# Altium project ControlBoard.PrjPcb (part 8 of 8)

## Sheet Voltages.SchDoc: Title
size A4; SchTemplateVer: V2.0; Author: Adam Mizerkiewicz; CompanyName: Adam Mizerkiewicz; DrawnBy: Adam Mizerkiewicz; Engineer: Adam Mizerkiewicz; Organization: Adam Mizerkiewicz; Address1: Sarnia 2/19; Address2: 61-058 Poznań; Revision: 0.0
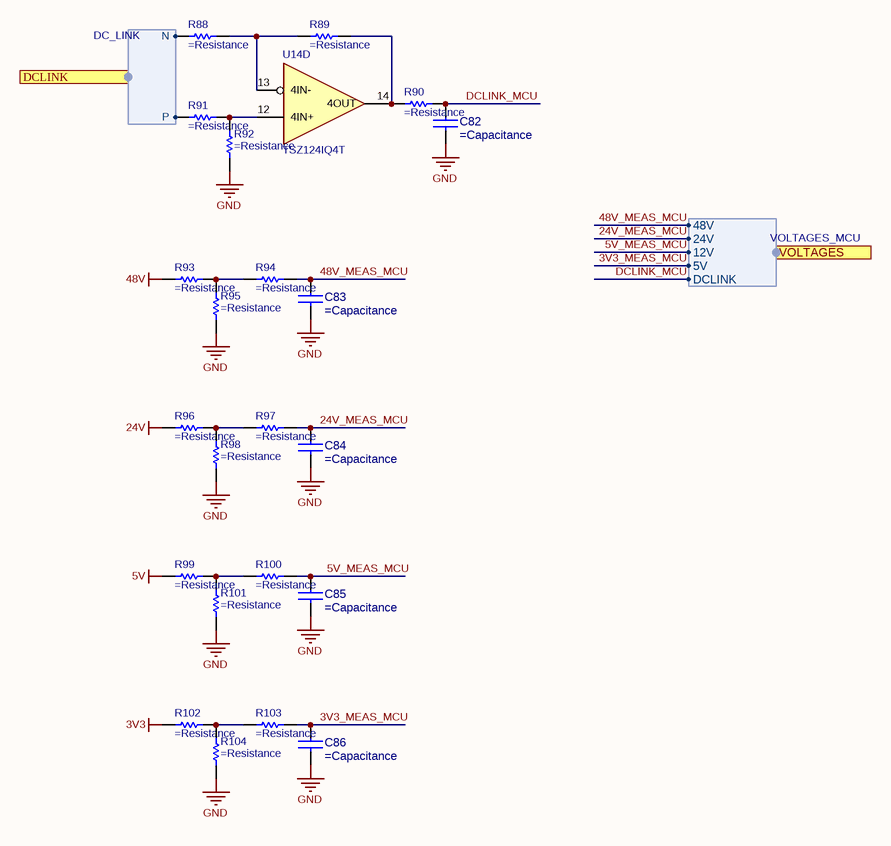
[diagram p15: Voltages.SchDoc]

### Parts
C82  (no value)  [C0402]
C83  (no value)  [C0402]
C84  (no value)  [C0402]
C85  (no value)  [C0402]
C86  (no value)  [C0402]
R88  (no value)  [R0402]
R89  (no value)  [R0402]
R90  (no value)  [R0402]
R91  (no value)  [R0402]
R92  (no value)  [R0402]
R93  (no value)  [R0402]
R94  (no value)  [R0402]
R95  (no value)  [R0402]
R96  (no value)  [R0402]
R97  (no value)  [R0402]
R98  (no value)  [R0402]
R99  (no value)  [R0402]
R100  (no value)  [R0402]
R101  (no value)  [R0402]
R102  (no value)  [R0402]
R103  (no value)  [R0402]
R104  (no value)  [R0402]
U14  TSZ124IQ4T  [VQFN16]  (part D of 5)

### Ports
DCLINK (harness DC_LINK), VOLTAGES (harness VOLTAGES_MCU)

### Harnesses
VOLTAGES_MCU: 24V, 12V, 5V, DCLINK, 48V
DC_LINK: N, P

### Nets
3V3: R102.1
5V: R99.1
24V: R96.1
48V: R93.1
GND: C82.2 C83.2 C84.2 C85.2 C86.2 R92.1 R95.1 R98.1 R101.1 R104.1
3V3_MEAS_MCU: C86.1 R103.2 ; port VOLTAGES.5V
5V_MEAS_MCU: C85.1 R100.2 ; port VOLTAGES.12V
24V_MEAS_MCU: C84.1 R97.2 ; port VOLTAGES.24V
48V_MEAS_MCU: C83.1 R94.2 ; port VOLTAGES.48V
DCLINK_MCU: C82.1 R90.2 ; port VOLTAGES.DCLINK
DCLINK_N: R88.1 ; port DCLINK.N
DCLINK_P: R91.1 ; port DCLINK.P
NetR88_2: R88.2 R89.1 U14.13(4IN-)
NetR89_2: R89.2 R90.1 U14.14(4OUT)
NetR91_2: R91.2 R92.2 U14.12(4IN+)
NetR93_2: R93.2 R94.1 R95.2
NetR96_2: R96.2 R97.1 R98.2
NetR99_2: R99.2 R100.1 R101.2
NetR102_2: R102.2 R103.1 R104.2

### Notes on the sheet
- Revision
  =Revision
- Sheet
  =SheetNumber / =SheetTotal

### Library data of the parts
C82-C86 = CAP0402-6.8nF-25V: Multilayer Ceramic Capacitors MLCC - SMD/SMT 25V 6800pF X7R 0402 10% AEC-Q200; Manufacturer: KEMET; Manufacturer Part Number: C0402C682K3RACAUTO; Capacitance: 6.8nF; Value: 6.8nF; Supplier 1: DigiKey; Supplier Part Number 1: 399-C0402C682K3RACAUTOCT-ND; Supplier: DigiKey; Supplier Part Number: 399-C0402C682K3RACAUTOCT-ND; RoHS: Compliant; Category: Ceramic Capacitors; Stock: 9600; Pricing: 1=0,26, 10=0,122, 50=0,075, 100=0,0595, 500=0,0515 (USD); Case/Package: 0402; China RoHS: Compliant; Dielectric: X7R; Dielectric Material: Ceramic; Height: 500µm; Length: 1mm; Lifecycle Status: Production; Material: Ceramic; Max Operating Temperature: 125°C; Min Operating Temperature: -55°C; Mounting Technology: Surface Mount; Pins: 2; Number of Terminals: 2; REACH SVHC: Yes; Voltage Rating: 25V; Voltage Rating (DC): 25V; Width: 500µm; ComponentLink1URL: https://datasheet.octopart.com:443/C0402C682K3RACAUTO-KEMET-datasheet-178087915.pdf?src-supplier=IHS; ComponentLink1Description: https://datasheet.octopart.com:443/C0402C682K3RACAUTO-KEMET-datasheet-178087915.pdf?src-supplier=IHS; ComponentLink2URL: https://datasheet.octopart.com:443/C0402C682K3RACAUTO-KEMET-datasheet-137357759.pdf?src-supplier=Upverter; ComponentLink2Description: https://datasheet.octopart.com:443/C0402C682K3RACAUTO-KEMET-datasheet-137357759.pdf?src-supplier=Upverter; ComponentLink3URL: https://datasheet.octopart.com:443/C0402C682K3RACAUTO-KEMET-datasheet-153706760.pdf?src-supplier=Electro+Sonic; ComponentLink3Description: https://datasheet.octopart.com:443/C0402C682K3RACAUTO-KEMET-datasheet-153706760.pdf?src-supplier=Electro+Sonic; ComponentLink4URL: https://datasheet.octopart.com:443/C0402C682K3RACAUTO-KEMET-datasheet-138896278.pdf?src-supplier=Farnell; ComponentLink4Description: https://datasheet.octopart.com:443/C0402C682K3RACAUTO-KEMET-datasheet-138896278.pdf?src-supplier=Farnell; ComponentLink5URL: https://datasheet.octopart.com/C0402C682K3RACAUTO-KEMET-datasheet-84169754.pdf; ComponentLink5Description: https://datasheet.octopart.com/C0402C682K3RACAUTO-KEMET-datasheet-84169754.pdf
R88 R90 R91 = RES0402-1k-1%: Res Thick Film 0402 1K Ohm 1% 0.063W(1/16W) ±50ppm/C Pad SMD Automotive T/R; Manufacturer: Vishay; Manufacturer Part Number: CRCW04021K00FHEDP; Resistance: 1kΩ; Max Power Dissipation: 63mW; Value: 1kΩ; Temperature Coefficient: 50ppm/°C; Voltage Rating: 50V; Supplier 1: DigiKey; Supplier Part Number 1: CRCW04021K00FHEDP-ND; Supplier: DigiKey; Supplier Part Number: CRCW04021K00FHEDP-ND; RoHS: Compliant; Category: Chip SMD Resistors; Pricing: 10000=0,03252 (USD); Case/Package: 0402; China RoHS: Non-Compliant; Composition: Thick Film; Contact Plating: Tin; Depth: 500µm; Features: Automotive AEC-Q200; Height: 350µm; Length: 990.6µm; Lifecycle Status: Production; Max Operating Temperature: 155°C; Military Standard: Not; Min Operating Temperature: -55°C; Mounting Technology: Surface Mount; Number of Terminals: 2; Number of Terminations: 2; Packaging: Tape & Reel; Power Dissipation: 63mW; Power Rating: 63mW; Radiation Hardening: No; REACH SVHC: Yes; Tolerance: 1%; Width: 500µm; Working Voltage: 50V; ComponentLink1URL: https://datasheet.octopart.com:443/CRCW04021K00FHEDP-Vishay-datasheet-182027415.pdf?src-supplier=IHS; ComponentLink1Description: https://datasheet.octopart.com:443/CRCW04021K00FHEDP-Vishay-datasheet-182027415.pdf?src-supplier=IHS; ComponentLink2URL: https://datasheet.octopart.com:443/CRCW04021K00FHEDP-Vishay-Dale-datasheet-141207190.pdf?src-supplier=Upverter; ComponentLink2Description: https://datasheet.octopart.com:443/CRCW04021K00FHEDP-Vishay-Dale-datasheet-141207190.pdf?src-supplier=Upverter; ComponentLink3URL: http://sigma.octopart.com:80/rohs_statement/Vishay-company-15.pdf?src-supplier=Compliance+Statements; ComponentLink3Description: http://sigma.octopart.com:80/rohs_statement/Vishay-company-15.pdf?src-supplier=Compliance+Statements
R89 R92 R95 R98 = RES0402-2k-1%: Res Thick Film 0402 2K Ohm 1% 1/16W 100ppm/C Molded SMD SMD Paper T/R; Manufacturer: Vishay; Manufacturer Part Number: CRCW04022K00FKEE; Resistance: 2kΩ; Max Power Dissipation: 63mW; Value: 2kΩ; Temperature Coefficient: 100ppm/°C; Voltage Rating: 50V; Supplier 1: DigiKey; Supplier Part Number 1: 541-CRCW04022K00FKEECT-ND; Supplier: DigiKey; Supplier Part Number: 541-CRCW04022K00FKEECT-ND; RoHS: Compliant; Category: Chip SMD Resistors; Stock: 10445; Pricing: 1=0,1, 10=0,03, 25=0,0224, 50=0,018, 100=0,0148, 250=0,01156, 500=0,01056, 1000=0,0084, 5000=0,00637 (USD); Case/Package: 0402; China RoHS: Non-Compliant; Composition: Thick Film; Contact Plating: Tin; Features: Automotive AEC-Q200; Height: 350µm; Lead Free: Lead Free; Length: 990.6µm; Lifecycle Status: Production; Max Operating Temperature: 155°C; Min Operating Temperature: -55°C; Mounting Technology: Surface Mount; Number of Terminals: 2; Number of Terminations: 2; Packaging: Tape & Reel; Power Dissipation: 63mW; Power Rating: 63mW; Radiation Hardening: No; REACH SVHC: Yes; Tolerance: 1%; Width: 500µm; Working Voltage: 50V; ComponentLink1URL: https://datasheet.octopart.com:443/CRCW04022K00FKEE-Vishay-datasheet-175423584.pdf?src-supplier=IHS; ComponentLink1Description: https://datasheet.octopart.com:443/CRCW04022K00FKEE-Vishay-datasheet-175423584.pdf?src-supplier=IHS; ComponentLink2URL: https://datasheet.octopart.com/D-CRCW-e3-Standard-Thick-Film-Chip-Resistors-Vishay-datasheet-family-64.pdf; ComponentLink2Description: https://datasheet.octopart.com/D-CRCW-e3-Standard-Thick-Film-Chip-Resistors-Vishay-datasheet-family-64.pdf; ComponentLink3URL: http://sigma.octopart.com:80/rohs_certificate/D-CRCW-e3-Standard-Thick-Film-Chip-Resistors-Vishay-family-102.pdf?src-supplier=Compliance+Statements; ComponentLink3Description: http://sigma.octopart.com:80/rohs_certificate/D-CRCW-e3-Standard-Thick-Film-Chip-Resistors-Vishay-family-102.pdf?src-supplier=Compliance+Statements
R93 = RES0402-47k-1%: Res Thick Film 0402 47K Ohm 1% 0.063W(1/16W) ±100ppm/C Pad SMD T/R; Manufacturer: Vishay; Manufacturer Part Number: CRCW040247K0FKEDC; Resistance: 47kΩ; Power Dissipation: 63mW; Value: 47kΩ; Temperature Coefficient: 100ppm/°C; Voltage Rating: 50V; Supplier 1: DigiKey; Supplier Part Number 1: 541-3966-1-ND; Supplier: DigiKey; Supplier Part Number: 541-3966-1-ND; RoHS: Compliant; Category: Chip SMD Resistors; Stock: 190917; Pricing: 1=0,1, 10=0,028, 25=0,0208, 50=0,0168, 100=0,0138, 250=0,01072, 500=0,009, 1000=0,00766, 5000=0,00554 (USD); Case/Package: 0402; China RoHS: Non-Compliant; Composition: Thick Film; Contact Plating: Tin; Height: 300µm; Lead Free: Lead Free; Length: 1mm; Lifecycle Status: Production; Max Operating Temperature: 155°C; Min Operating Temperature: -55°C; Mounting Technology: Surface Mount; Number of Terminals: 2; Power Rating: 63mW; REACH SVHC: Yes; Schedule B: 8533210045, 8533210045|8533210045|8533210045|8533210045|8533210045|8533210045|8533210045|8533210045|8533210045|8533210045|8533210045|8533210045|8533210045|8533210045|8533210045|8533210045|8533210045|8533210045|8533210045|8533210045|8533210045|8533210045|8533210045|85; Termination: Wraparound; Tolerance: 1%; Width: 500µm; Working Voltage: 50V; ComponentLink1URL: https://datasheet.octopart.com:443/CRCW040247K0FKEDC-Vishay-datasheet-102570912.pdf?src-supplier=Future+Electronics; ComponentLink1Description: https://datasheet.octopart.com:443/CRCW040247K0FKEDC-Vishay-datasheet-102570912.pdf?src-supplier=Future+Electronics; ComponentLink2URL: https://datasheet.octopart.com:443/CRCW040247K0FKEDC-Vishay-datasheet-62316122.pdf?src-supplier=Future+Electronics; ComponentLink2Description: https://datasheet.octopart.com:443/CRCW040247K0FKEDC-Vishay-datasheet-62316122.pdf?src-supplier=Future+Electronics; ComponentLink3URL: https://datasheet.octopart.com:443/CRCW040247K0FKEDC-Vishay-datasheet-175423585.pdf?src-supplier=IHS; ComponentLink3Description: https://datasheet.octopart.com:443/CRCW040247K0FKEDC-Vishay-datasheet-175423585.pdf?src-supplier=IHS; ComponentLink4URL: http://sigma.octopart.com:80/rohs_statement/Vishay-company-15.pdf?src-supplier=Compliance+Statements; ComponentLink4Description: http://sigma.octopart.com:80/rohs_statement/Vishay-company-15.pdf?src-supplier=Compliance+Statements
R94 R97 R100 R102-R104 = RES0402-10k-1%: Res Thick Film 0402 10K Ohm 1% 0.063W(1/16W) ±100ppm/C Pad SMD T/R Automotive AEC-Q200; Manufacturer: Vishay; Manufacturer Part Number: CRCW040210K0FKEE; Resistance: 10kΩ; Max Power Dissipation: 63mW; Value: 10kΩ; Temperature Coefficient: 100ppm/°C; Voltage Rating: 50V; Supplier 1: DigiKey; Supplier Part Number 1: 541-2954-1-ND; Supplier: DigiKey; Supplier Part Number: 541-2954-1-ND; RoHS: Compliant; Category: Chip SMD Resistors; Pricing: 1=0,1, 10=0,03, 25=0,0224, 50=0,018, 100=0,0148, 250=0,01156, 500=0,00974, 1000=0,00832, 5000=0,00637 (USD); Case/Package: 0402; Case Code (Imperial): 0402; Case Code (Metric): 1005; China RoHS: Non-Compliant; Composition: Thick Film; Contact Plating: Tin; Depth: 500µm; Features: Automotive AEC-Q200; Height: 350µm; Lead Free: Lead Free; Length: 990.6µm; Lifecycle Status: Production; Max Operating Temperature: 155°C; Military Standard: Not; Min Operating Temperature: -55°C; Mounting Technology: Surface Mount; Number of Terminals: 2; Number of Terminations: 2; Packaging: Tape & Reel; Power Dissipation: 63mW; Power Rating: 63mW; Radiation Hardening: No; REACH SVHC: Yes; Schedule B: 8533210045, 8533210045|8533210045|8533210045|8533210045|8533210045|8533210045|8533210045|8533210045|8533210045|8533210045|8533210045|8533210045|8533210045|8533210045|8533210045|8533210045|8533210045|8533210045|8533210045|8533210045|8533210045|8533210045|8533210045|85; Tolerance: 1%; Voltage Rating (DC): 50V; Width: 500µm; Working Voltage: 50V; ComponentLink1URL: https://datasheet.octopart.com:443/CRCW040210K0FKEE-Vishay-datasheet-175423584.pdf?src-supplier=IHS; ComponentLink1Description: https://datasheet.octopart.com:443/CRCW040210K0FKEE-Vishay-datasheet-175423584.pdf?src-supplier=IHS; ComponentLink2URL: https://datasheet.octopart.com:443/CRCW040210K0FKEE-Vishay-datasheet-62316122.pdf?src-supplier=Future+Electronics; ComponentLink2Description: https://datasheet.octopart.com:443/CRCW040210K0FKEE-Vishay-datasheet-62316122.pdf?src-supplier=Future+Electronics; ComponentLink3URL: http://sigma.octopart.com:80/rohs_statement/Vishay-company-15.pdf?src-supplier=Compliance+Statements; ComponentLink3Description: http://sigma.octopart.com:80/rohs_statement/Vishay-company-15.pdf?src-supplier=Compliance+Statements
R96 R99 = RES0402-20k-1%: Res Thick Film 0402 20K Ohm 1% 0.063W(1/16W) ±100ppm/C Pad SMD T/R; Manufacturer: Vishay; Manufacturer Part Number: CRCW040220K0FKEDC; Resistance: 20kΩ; Power Dissipation: 63mW; Value: 20kΩ; Temperature Coefficient: 100ppm/°C; Voltage Rating: 50V; Supplier 1: DigiKey; Supplier Part Number 1: 541-3969-1-ND; Supplier: DigiKey; Supplier Part Number: 541-3969-1-ND; RoHS: Compliant; Category: Chip SMD Resistors; Stock: 7862; Pricing: 1=0,1, 10=0,028, 25=0,0208, 50=0,0168, 100=0,0138, 250=0,01072, 500=0,009, 1000=0,00766, 5000=0,00554 (USD); Case/Package: 0402; China RoHS: Non-Compliant; Composition: Thick Film; Contact Plating: Tin; Height: 300µm; Lead Free: Lead Free; Length: 1mm; Lifecycle Status: Production; Max Operating Temperature: 155°C; Min Operating Temperature: -55°C; Mounting Technology: Surface Mount; Number of Terminals: 2; Power Rating: 63mW; REACH SVHC: Yes; Schedule B: 8533210045, 8533210045|8533210045|8533210045|8533210045|8533210045; Termination: Wraparound; Tolerance: 1%; Width: 500µm; Working Voltage: 50V; ComponentLink1URL: https://datasheet.octopart.com:443/CRCW040220K0FKEDC-Vishay-datasheet-102570912.pdf?src-supplier=Upverter; ComponentLink1Description: https://datasheet.octopart.com:443/CRCW040220K0FKEDC-Vishay-datasheet-102570912.pdf?src-supplier=Upverter; ComponentLink2URL: https://datasheet.octopart.com:443/CRCW040220K0FKEDC-Vishay-datasheet-175423585.pdf?src-supplier=IHS; ComponentLink2Description: https://datasheet.octopart.com:443/CRCW040220K0FKEDC-Vishay-datasheet-175423585.pdf?src-supplier=IHS; ComponentLink3URL: https://datasheet.octopart.com:443/CRCW040220K0FKEDC-Vishay-datasheet-100063072.pdf?src-supplier=Future+Electronics; ComponentLink3Description: https://datasheet.octopart.com:443/CRCW040220K0FKEDC-Vishay-datasheet-100063072.pdf?src-supplier=Future+Electronics; ComponentLink4URL: https://datasheet.octopart.com:443/CRCW040220K0FKEDC-Vishay-datasheet-62316122.pdf?src-supplier=Future+Electronics; ComponentLink4Description: https://datasheet.octopart.com:443/CRCW040220K0FKEDC-Vishay-datasheet-62316122.pdf?src-supplier=Future+Electronics; ComponentLink5URL: http://sigma.octopart.com:80/rohs_statement/Vishay-company-15.pdf?src-supplier=Compliance+Statements; ComponentLink5Description: http://sigma.octopart.com:80/rohs_statement/Vishay-company-15.pdf?src-supplier=Compliance+Statements
R101 = RES0402-30k-1%: 0402 30K Ohms 1% High Power Thick Film Surface Mount Chip Resistor; Manufacturer: Vishay; Manufacturer Part Number: CRCW040230K0FKEDHP; Manufacturer Package Identifier: CRCW0402-HPe3; Resistance: 30kΩ; Max Power Dissipation: 125mW; Power Dissipation: 200mW; Value: 30kΩ; Temperature Coefficient: 100ppm/°C; Voltage Rating: 50V; Supplier 1: DigiKey; Supplier Part Number 1: CRCW040230K0FKEDHPCT-ND; Supplier: DigiKey; Supplier Part Number: CRCW040230K0FKEDHPCT-ND; RoHS: Compliant; Category: Chip SMD Resistors; Stock: 9449; Pricing: 1=0,13, 10=0,061, 25=0,0472, 50=0,0392, 100=0,0331, 250=0,027, 500=0,0235, 1000=0,02072, 5000=0,01631 (USD); Case/Package: 0402; Case Code (Imperial): 0402; Case Code (Metric): 1005; China RoHS: Non-Compliant; Composition: Thick Film; Contact Plating: Tin; Features: Automotive AEC-Q200; Height: 300µm; Lead Free: Lead Free; Length: 990.6µm; Lifecycle Status: Production; Max Operating Temperature: 155°C; Min Operating Temperature: -55°C; Mounting Technology: Surface Mount; Number of Terminals: 2; Number of Terminations: 2; Packaging: Digi-Reel®; Power Rating: 200mW; Radiation Hardening: No; REACH SVHC: Yes; Tolerance: 1%; Width: 500µm; Working Voltage: 50V; ComponentLink1URL: https://datasheet.octopart.com/CRCW040230K0FKEDHP-Vishay-datasheet-83567917.pdf; ComponentLink1Description: https://datasheet.octopart.com/CRCW040230K0FKEDHP-Vishay-datasheet-83567917.pdf; ComponentLink2URL: https://datasheet.octopart.com/D-CRCW-e3-Standard-Thick-Film-Chip-Resistors-Vishay-datasheet-family-64.pdf; ComponentLink2Description: https://datasheet.octopart.com/D-CRCW-e3-Standard-Thick-Film-Chip-Resistors-Vishay-datasheet-family-64.pdf; ComponentLink3URL: https://datasheet.octopart.com:443/CRCW040230K0FKEDHP-Vishay-datasheet-137113427.pdf?src-supplier=X-ON; ComponentLink3Description: https://datasheet.octopart.com:443/CRCW040230K0FKEDHP-Vishay-datasheet-137113427.pdf?src-supplier=X-ON; ComponentLink4URL: https://datasheet.octopart.com:443/CRCW040230K0FKEDHP-Vishay-datasheet-62316122.pdf?src-supplier=Future+Electronics; ComponentLink4Description: https://datasheet.octopart.com:443/CRCW040230K0FKEDHP-Vishay-datasheet-62316122.pdf?src-supplier=Future+Electronics; ComponentLink5URL: http://sigma.octopart.com:80/rohs_certificate/D-CRCW-e3-Standard-Thick-Film-Chip-Resistors-Vishay-family-102.pdf?src-supplier=Compliance+Statements; ComponentLink5Description: http://sigma.octopart.com:80/rohs_certificate/D-CRCW-e3-Standard-Thick-Film-Chip-Resistors-Vishay-family-102.pdf?src-supplier=Compliance+Statements
U14 = TSZ124IQ4T: TSZ124 Series 5.5V 400 kHz Rail to Rail SMT Operational Amplifier - TSSOP-14; Manufacturer: STMicroelectronics; Bandwidth: 400kHz; Common Mode Rejection Ratio: 115dB; Input Bias Current: 200pA; Input Offset Voltage (Vos): 8µV; Max Supply Current: 40µA; Max Supply Voltage: 6V; Min Supply Voltage: 1.8V; Nominal Supply Current: 31µA; Number of Channels: 4; Operating Supply Voltage: 3.3V; Output Current: 17mA; Output Current per Channel: 18mA; Slew Rate: 0.19V/µs; Voltage Gain: 135dB; Supplier 1: DigiKey; Supplier Part Number 1: 497-14337-1-ND; Supplier: DigiKey; Supplier Part Number: 497-14337-1-ND; Manufacturer Part Number: TSZ124IQ4T; RoHS: Compliant; Category: Amplifiers - Op Amps, Buffer, Instrumentation; Stock: 10565; Pricing: 1=1,86, 10=1,367, 25=1,2444, 100=1,1092, 250=1,0448, 500=1,00596, 1000=0,97398 (USD); Case/Package: QFN; China RoHS: Compliant; Gain Bandwidth Product: 400kHz; Height - Seated (Max): 1mm; Length: 3mm; Lifecycle Status: Production; Max Operating Temperature: 125°C; Min Operating Temperature: -40°C; Mounting Technology: Surface Mount; Number of Circuits: 4; Pins: 16; Number of Terminals: 4; Operating Supply Current: 31µA; Packaging: Tape and Reel; REACH SVHC: Yes; Schedule B: 8542330000, 8542330000|8542330000|8542330000|8542330000|8542330000; Terminal Pitch: 500µm; Unity Gain Bandwidth Product: 400kHz; Width: 3mm; ComponentLink1URL: https://datasheet.octopart.com:443/TSZ124IQ4T-STMicroelectronics-datasheet-62337710.pdf?src-supplier=Future+Electronics; ComponentLink1Description: https://datasheet.octopart.com:443/TSZ124IQ4T-STMicroelectronics-datasheet-62337710.pdf?src-supplier=Future+Electronics; ComponentLink2URL: https://datasheet.octopart.com:443/TSZ124IQ4T-STMicroelectronics-datasheet-16350222.pdf?src-supplier=STMicroelectronics; ComponentLink2Description: https://datasheet.octopart.com:443/TSZ124IQ4T-STMicroelectronics-datasheet-16350222.pdf?src-supplier=STMicroelectronics; ComponentLink3URL: https://datasheet.octopart.com:443/TSZ124IQ4T-STMicroelectronics-datasheet-140259870.pdf?src-supplier=Farnell; ComponentLink3Description: https://datasheet.octopart.com:443/TSZ124IQ4T-STMicroelectronics-datasheet-140259870.pdf?src-supplier=Farnell; ComponentLink4URL: https://datasheet.octopart.com:443/TSZ124IQ4T-STMicroelectronics-datasheet-159009515.pdf?src-supplier=SHENGYU+ELECTRONICS; ComponentLink4Description: https://datasheet.octopart.com:443/TSZ124IQ4T-STMicroelectronics-datasheet-159009515.pdf?src-supplier=SHENGYU+ELECTRONICS; ComponentLink5URL: https://datasheet.octopart.com:443/TSZ124IQ4T-STMicroelectronics-datasheet-165583692.pdf?src-supplier=TME; ComponentLink5Description: https://datasheet.octopart.com:443/TSZ124IQ4T-STMicroelectronics-datasheet-165583692.pdf?src-supplier=TME

## Sheet Encoder.SchDoc: Title
size A4; SchTemplateVer: V2.0; Author: Adam Mizerkiewicz; CompanyName: Adam Mizerkiewicz; DrawnBy: Adam Mizerkiewicz; Engineer: Adam Mizerkiewicz; Organization: Adam Mizerkiewicz; Address1: Sarnia 2/19; Address2: 61-058 Poznań; Revision: 0.0
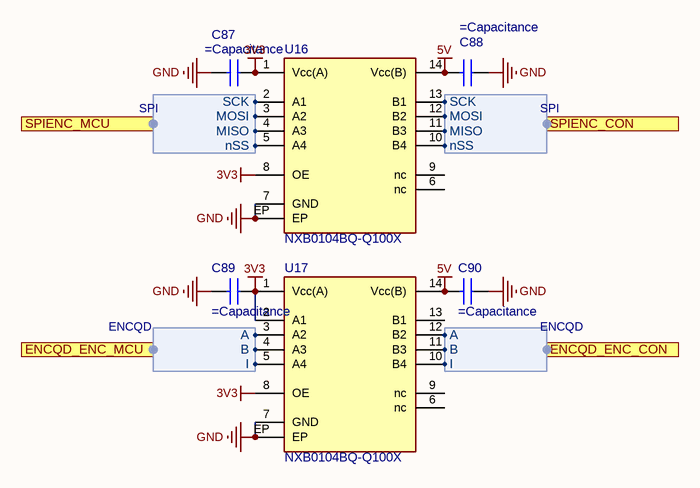
[diagram p16: Encoder.SchDoc]

### Parts
C87  (no value)  [C0402]
C88  (no value)  [C0402]
C89  (no value)  [C0402]
C90  (no value)  [C0402]
U16  NXB0104BQ-Q100X  [DHVQFN14]
U17  NXB0104BQ-Q100X  [DHVQFN14]

### Ports
ENCQD_ENC_CON (harness ENCQD), ENCQD_ENC_MCU (harness ENCQD), SPIENC_CON (harness SPI), SPIENC_MCU (harness SPI)

### Harnesses
SPI: MISO, MOSI, SCK, nSS
ENCQD: B, A, I

### Nets
3V3: C87.1 C89.1 U16.1(Vcc(A)) U16.8(OE) U17.1(Vcc(A)) U17.2(A1) U17.8(OE)
5V: C88.2 C90.2 U16.14(Vcc(B)) U17.14(Vcc(B))
GND: C87.2 C88.1 C89.2 C90.1 U16.7(GND) U16.EP U17.7(GND) U17.EP
NetU16_2: U16.2(A1) ; port SPIENC_MCU.SCK
NetU16_3: U16.3(A2) ; port SPIENC_MCU.MOSI
NetU16_4: U16.4(A3) ; port SPIENC_MCU.MISO
NetU16_5: U16.5(A4) ; port SPIENC_MCU.nSS
NetU16_10: U16.10(B4) ; port SPIENC_CON.nSS
NetU16_11: U16.11(B3) ; port SPIENC_CON.MISO
NetU16_12: U16.12(B2) ; port SPIENC_CON.MOSI
NetU16_13: U16.13(B1) ; port SPIENC_CON.SCK
NetU17_3: U17.3(A2) ; port ENCQD_ENC_MCU.A
NetU17_4: U17.4(A3) ; port ENCQD_ENC_MCU.B
NetU17_5: U17.5(A4) ; port ENCQD_ENC_MCU.I
NetU17_10: U17.10(B4) ; port ENCQD_ENC_CON.I
NetU17_11: U17.11(B3) ; port ENCQD_ENC_CON.B
NetU17_12: U17.12(B2) ; port ENCQD_ENC_CON.A

Not connected (* = marked no-connect by the designer): U16 6(nc) 9(nc); U17 6(nc) 9(nc) 13(B1)

### Notes on the sheet
- Revision
  =Revision
- Sheet
  =SheetNumber / =SheetTotal

### Library data of the parts
C87-C90 = CAP0402-0.1uF-50V: CAP CER 0.1UF 50V X7R 0402; Manufacturer: Walsin Technologies; Manufacturer Part Number: 0402B104K500CT; Capacitance: 100nF; Material: 4241ConductorMaterial; Value: 100nF; Tolerance: 10%; Dielectric: 1511DielectricType; Supplier: Digikey; Supplier Part Number: 1292-1176-1-ND; RoHS: Yes; Category: Ceramic Capacitors; Stock: 109567; Pricing: 1=0,08, 10=0,005, 100=0,0032, 1000=0,0024 (USD); Mounting Technology: Surface Mount; Case/Package: 0402; Case Code (Imperial): 0402; Case Code (Metric): 1005; Min Operating Temperature: -55°C; Max Operating Temperature: 125°C; Packaging: Cut Tape; Voltage Rating: 50V; Series: -; Voltage Rating (DC): 50V; Height: 550um; RoHS Compliant: Yes; Lead Free: 5697LeadFree; ComponentLink1URL: http://datasheet.octopart.com/0402B104K500CT-Walsin-Technologies-datasheet-26371553.pdf?src-supplier=Arrow+Electronics; ComponentLink1Description: http://datasheet.octopart.com/0402B104K500CT-Walsin-Technologies-datasheet-26371553.pdf?src-supplier=Arrow+Electronics; ComponentLink2URL: http://datasheet.octopart.com/0402B104K500CT-Walsin-Technologies-datasheet-26371553.pdf?src-supplier=Verical; ComponentLink2Description: http://datasheet.octopart.com/0402B104K500CT-Walsin-Technologies-datasheet-26371553.pdf?src-supplier=Verical; ComponentLink3URL: http://www.passivecomponent.com/indexsea/0402B104K500CT-IE.pdf?src-supplier=Digikey; ComponentLink3Description: http://www.passivecomponent.com/indexsea/0402B104K500CT-IE.pdf?src-supplier=Digikey; ComponentLink4URL: http://datasheet.octopart.com/0402B104K500CT-Walsin-Technologies-datasheet-26371553.pdf?src-supplier=Rs; ComponentLink4Description: http://datasheet.octopart.com/0402B104K500CT-Walsin-Technologies-datasheet-26371553.pdf?src-supplier=Rs; ComponentLink5URL: https://datasheet.octopart.com/0402B104K500CT-Walsin-Technologies-datasheet-128065749.pdf?src-supplier=Future+Electronics; ComponentLink5Description: https://datasheet.octopart.com/0402B104K500CT-Walsin-Technologies-datasheet-128065749.pdf?src-supplier=Future+Electronics; ComponentLink6URL: http://datasheet.octopart.com/0402B104K500CT-Walsin-Technologies-datasheet-26371553.pdf?src-supplier=Farnell; ComponentLink6Description: http://datasheet.octopart.com/0402B104K500CT-Walsin-Technologies-datasheet-26371553.pdf?src-supplier=Farnell; ComponentLink7URL: http://datasheet.octopart.com/0402B104K500CT-Walsin-Technologies-datasheet-26371553.pdf?src-supplier=Newark; ComponentLink7Description: http://datasheet.octopart.com/0402B104K500CT-Walsin-Technologies-datasheet-26371553.pdf?src-supplier=Newark; ComponentLink8URL: http://datasheet.octopart.com/0402B104K500CT-Walsin-Technologies-datasheet-26371553.pdf?src-supplier=Mouser; ComponentLink8Description: http://datasheet.octopart.com/0402B104K500CT-Walsin-Technologies-datasheet-26371553.pdf?src-supplier=Mouser; ComponentLink9URL: http://datasheet.octopart.com/0402B104K500CT-Walsin-Technologies-datasheet-26371553.pdf?src-supplier=Digikey; ComponentLink9Description: http://datasheet.octopart.com/0402B104K500CT-Walsin-Technologies-datasheet-26371553.pdf?src-supplier=Digikey; ComponentLink10URL: https://datasheet.octopart.com/0402B104K500CT-Walsin-Technologies-datasheet-62066062.pdf?src-supplier=TME; ComponentLink10Description: https://datasheet.octopart.com/0402B104K500CT-Walsin-Technologies-datasheet-62066062.pdf?src-supplier=TME; ComponentLink11URL: http://datasheet.octopart.com/0402B104K500CT-Walsin-Technologies-datasheet-26371553.pdf?src-supplier=Freelance+Electronics; ComponentLink11Description: http://datasheet.octopart.com/0402B104K500CT-Walsin-Technologies-datasheet-26371553.pdf?src-supplier=Freelance+Electronics; ComponentLink12URL: http://datasheet.octopart.com/0402B104K500CT-Walsin-Technologies-datasheet-26371553.pdf?src-supplier=Component+Sense; ComponentLink12Description: http://datasheet.octopart.com/0402B104K500CT-Walsin-Technologies-datasheet-26371553.pdf?src-supplier=Component+Sense; ComponentLink13URL: http://datasheet.octopart.com/0402B104K500CT-Walsin-Technologies-datasheet-26371553.pdf?src-supplier=NAC+Semi; ComponentLink13Description: http://datasheet.octopart.com/0402B104K500CT-Walsin-Technologies-datasheet-26371553.pdf?src-supplier=NAC+Semi; ComponentLink14URL: https://datasheet.octopart.com/0402B104K500CT-Walsin-Technologies-datasheet-136037192.pdf?src-supplier=TECHDesign; ComponentLink14Description: https://datasheet.octopart.com/0402B104K500CT-Walsin-Technologies-datasheet-136037192.pdf?src-supplier=TECHDesign; Supplier 1: Digikey; Supplier Part Number 1: 1292-1176-1-ND
U16 U17 = NXB0104BQ-Q100: 1.65V~5.5V 1 2 1.2V~3.6V 100Mbps DHVQFN-14-EP(2.5x3) Translators / Level Shifters ROHS; Manufacturer: Nexperia; Manufacturer Lifecycle Status: RELEASED FOR SUPPLY; Supplier: DigiKey; Supplier Part Number: 1727-NXB0104BQ-Q100XCT-ND; Manufacturer Part Number: NXB0104BQ-Q100X; RoHS: Compliant; Category: Voltage Level Shifters; Stock: 3106; Pricing: 1=0,73, 10=0,517, 25=0,4648, 100=0,4068, 250=0,3792, 500=0,36258, 1000=0,35771 (USD); Lifecycle Status: Production; ComponentLink1URL: https://datasheet.octopart.com:443/NXB0104BQ-Q100X-Nexperia-datasheet-137152397.pdf?src-supplier=Future+Electronics; ComponentLink1Description: https://datasheet.octopart.com:443/NXB0104BQ-Q100X-Nexperia-datasheet-137152397.pdf?src-supplier=Future+Electronics; Supplier 1: DigiKey; Supplier Part Number 1: 1727-NXB0104BQ-Q100XCT-ND

## Nets that join several sheets
1V2: McuSupply (9 pins), Supply (C94.2 U19.4 U19.5)
3V3: Mcu (5 pins), McuSupply (21 pins), TOP/U_CAN (C80_TOP_U_CAN#1.1 U15_TOP_U_CAN#1.5), TOP/U_CAN (C80_TOP_U_CAN#2.1 U15_TOP_U_CAN#2.5), PowerBoardConnector (9 pins), Mems (5 pins), PhaseCurrents (C77.1 U14.2), Resolver (12 pins), ResistiveTempSensors (D3.2), Supply (6 pins), UserInterface (D6.1), Voltages (R102.1), Encoder (7 pins)
3V3REF: Mcu (R30.2 R31.2), McuSupply (6 pins), Supply (C66.1 C67.1 TP?#13.1 U11.6)
5V: TOP/U_CAN (C81_TOP_U_CAN#1.2 U15_TOP_U_CAN#1.3), TOP/U_CAN (C81_TOP_U_CAN#2.2 U15_TOP_U_CAN#2.3), Resolver (11 pins), ResistiveTempSensors (7 pins), Supply (25 pins), Voltages (R99.1), Encoder (C88.2 C90.2 U16.14 U17.14)
24V: PowerBoardConnector (7 pins), Supply (5 pins), Voltages (R96.1)
48V: DigitalOutputs (8 pins), Supply (13 pins), Voltages (R93.1)
48V_IN: ExternalConnectors (PWR.1), Supply (F1.2 TP?#8.1)
GND: Mcu (7 pins), McuSupply (39 pins), TOP/U_CAN (C80_TOP_U_CAN#1.2 C81_TOP_U_CAN#1.1 U15_TOP_U_CAN#1.2), DIgitalInputs (6 pins), DigitalOutputs (20 pins), ExternalConnectors (33 pins), TOP/U_CAN (C80_TOP_U_CAN#2.2 C81_TOP_U_CAN#2.1 U15_TOP_U_CAN#2.2), PowerBoardConnector (22 pins), Mems (8 pins), PhaseCurrents (15 pins), Resolver (26 pins), ResistiveTempSensors (13 pins), Supply (56 pins), Voltages (10 pins), Encoder (8 pins)
GND_IN: ExternalConnectors (PWR.2), Supply (D7.1 Q1.1 Q1.2 Q1.3)
VCS: ExternalConnectors (6 pins), Supply (C106.2 C107.1 TP?#15.1 U21.8)
VENC: ExternalConnectors (POS.7), Supply (C102.2 C103.1 TP?#14.1 U20.8)
3F_RECT_FB: Mcu (U7.D9), PowerBoardConnector (P2.53)
3F_RECT_ON: Mcu (U7.D10), PowerBoardConnector (P2.52)
3V3_MEAS_MCU: Mcu (U7.G2), Voltages (C86.1 R103.2)
5V_MEAS_MCU: Mcu (U7.G3), Voltages (C85.1 R100.2)
24V_MEAS_MCU: Mcu (U7.G1), Voltages (C84.1 R97.2)
48V_MEAS_MCU: Mcu (U7.F1), Voltages (C83.1 R94.2)
ACC/GYRO_INT1: Mcu (U7.A5), Mems (U8.7)
ACC/GYRO_INT2: Mcu (U7.B5), Mems (U8.3)
CAN_N: TOP/U_CAN (U15_TOP_U_CAN#1.6), TOP/U_CAN (U15_TOP_U_CAN#2.6)
CAN_P: TOP/U_CAN (U15_TOP_U_CAN#1.7), TOP/U_CAN (U15_TOP_U_CAN#2.7)
CURR_MCU_U: Mcu (U7.K3), PhaseCurrents (C73.1 R69.2 TP?#4.1)
CURR_MCU_V: Mcu (U7.J3), PhaseCurrents (C75.1 R76.2 TP?#5.1)
CURR_MCU_W: Mcu (U7.H1), PhaseCurrents (C78.1 R83.2 TP?#6.1)
CURR_SNSR_U: ExternalConnectors (CS_U.3), PhaseCurrents (R70.1 R72.2)
CURR_SNSR_V: ExternalConnectors (CS_V.3), PhaseCurrents (R77.1 R79.2)
CURR_SNSR_W: ExternalConnectors (CS_W.3), PhaseCurrents (R84.1 R86.2)
DCLINK_DIAG: Mcu (U7.E8), PowerBoardConnector (P2.42)
DCLINK_FASTBLEED: Mcu (U7.E9), PowerBoardConnector (P2.43)
DCLINK_MCU: Mcu (U7.N2), Voltages (C82.1 R90.2)
DCLINK_N: PowerBoardConnector (P2.49), Voltages (R88.1)
DCLINK_P: PowerBoardConnector (P2.48), Voltages (R91.1)
DIN_CON1: DIgitalInputs (R1.1), ExternalConnectors (TH_DIN.6)
DIN_CON2: DIgitalInputs (R3.1), ExternalConnectors (TH_DIN.7)
DIN_CON3: DIgitalInputs (R5.1), ExternalConnectors (TH_DIN.2)
DOUT_PWR1: DigitalOutputs (5 pins), ExternalConnectors (DOUT.1)
DOUT_PWR2: DigitalOutputs (5 pins), ExternalConnectors (DOUT.2)
DOUT_PWR3: DigitalOutputs (5 pins), ExternalConnectors (DOUT.3)
DOUT_PWR4: DigitalOutputs (5 pins), ExternalConnectors (DOUT.4)
ENABLE_DRIVERS: Mcu (U7.A7), PowerBoardConnector (P2.40)
ENCQD_ENC_A: Mcu (U7.K13), ExternalConnectors (POS.10)
ENCQD_ENC_B: Mcu (U7.J13), ExternalConnectors (POS.11)
ENCQD_ENC_I: Mcu (U7.L10), ExternalConnectors (POS.12)
ENCQD_RES_A: Mcu (U7.K9), Resolver (U6.29)
ENCQD_RES_B: Mcu (U7.K10), Resolver (U6.30)
ENCQD_RES_I: Mcu (U7.K12), Resolver (U6.31)
I2C_SCL: Mcu (U7.J11), PowerBoardConnector (P2.44)
I2C_SDA: Mcu (U7.J12), PowerBoardConnector (P2.45)
NetU15_TOP_U_CAN#1_1: TOP/U_CAN (U15_TOP_U_CAN#1.1), TOP/U_CAN (U15_TOP_U_CAN#2.1)
NetU15_TOP_U_CAN#1_4: TOP/U_CAN (U15_TOP_U_CAN#1.4), TOP/U_CAN (U15_TOP_U_CAN#2.4)
NetU15_TOP_U_CAN#1_8: TOP/U_CAN (U15_TOP_U_CAN#1.8), TOP/U_CAN (U15_TOP_U_CAN#2.8)
OUTPUT_SHDN: Mcu (U7.A3), Resolver (R20.2 U5.3)
PB_IO_INT: Mcu (U7.B7), PowerBoardConnector (P2.39)
PBDET_nEN: Mcu (U7.A2), PowerBoardConnector (U13.3)
PBDET_WDO: Mcu (U7.C3), PowerBoardConnector (P2.8 R65.2)
PCTRL_ENA: Mcu (U7.D11), PowerBoardConnector (P2.9)
PCTRL_nPG: Mcu (U7.B13), PowerBoardConnector (P2.10)
PCTRL_UH: Mcu (U7.E7), PowerBoardConnector (P2.11)
PCTRL_UL: Mcu (U7.A6), PowerBoardConnector (P2.12)
PCTRL_VH: Mcu (U7.B6), PowerBoardConnector (P2.13)
PCTRL_VL: Mcu (U7.C6), PowerBoardConnector (P2.14)
PCTRL_WH: Mcu (U7.D6), PowerBoardConnector (P2.15)
PCTRL_WL: Mcu (U7.E6), PowerBoardConnector (P2.16)
PG_24V: Mcu (U7.A8), Supply (R48.1 U10.6)
PG_ 5V: Mcu (U7.A9), Supply (R42.1 U9.6)
RES_COS_N: ExternalConnectors (POS.4), Resolver (U6.44)
RES_COS_P: ExternalConnectors (POS.13), Resolver (U6.45)
RES_EXC_N: ExternalConnectors (POS.5), Resolver (R19.1 U5.9)
RES_EXC_P: ExternalConnectors (POS.16), Resolver (R15.1 U5.13)
RES_SIN_N: ExternalConnectors (POS.14), Resolver (U6.42)
RES_SIN_P: ExternalConnectors (POS.15), Resolver (U6.41)
RGB_B: Mcu (U7.B10), UserInterface (R106.1)
RGB_G: Mcu (U7.A10), UserInterface (R107.1)
RGB_R: Mcu (U7.C9), UserInterface (R105.1)
SLAVE_RESET: Mcu (U7.C7), PowerBoardConnector (P2.41)
SPIENC_MISO: Mcu (U7.B8), ExternalConnectors (POS.9)
SPIENC_MOSI: Mcu (U7.D7), ExternalConnectors (POS.8)
SPIENC_nSS: Mcu (U7.F2), ExternalConnectors (POS.3)
SPIENC_SCK: Mcu (U7.D2), ExternalConnectors (POS.2)
SPIRES_MISO: Mcu (U7.D4), Resolver (U6.11)
SPIRES_MOSI: Mcu (U7.C4), Resolver (U6.12)
SPIRES_nSS: Mcu (U7.D1), Resolver (U6.2)
SPIRES_SCK: Mcu (U7.D3), Resolver (U6.13)
THERM_OUT1: ExternalConnectors (TH_DIN.3), ResistiveTempSensors (Q2.6)
THERM_OUT2: ExternalConnectors (TH_DIN.1), ResistiveTempSensors (Q2.3)
THERM_OUT3: ExternalConnectors (TH_DIN.4), ResistiveTempSensors (Q4.6)
THERM_OUT4: ExternalConnectors (TH_DIN.5), ResistiveTempSensors (Q4.3)